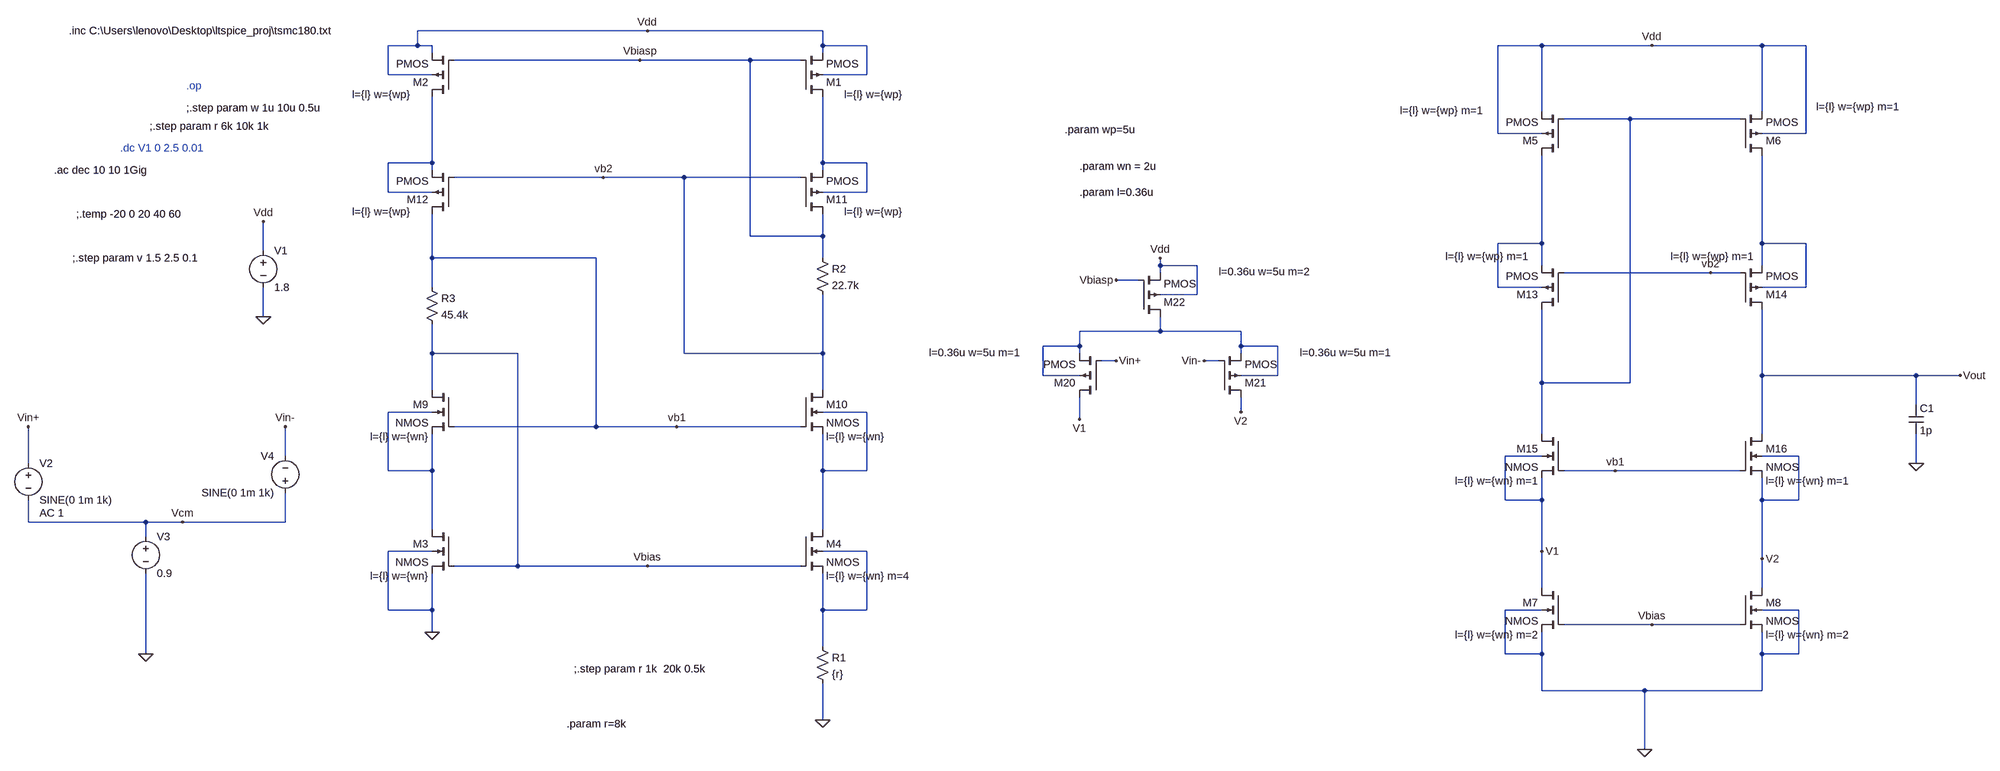
[diagram p0: schematic pmos-folded.asc]
pmos-folded.asc, the LTspice schematic file:
Version 4
SHEET 1 3392 1732
WIRE 336 80 -192 80
WIRE 848 80 336 80
WIRE -192 112 -192 80
WIRE -192 112 -256 112
WIRE -160 112 -192 112
WIRE 848 112 848 80
WIRE 944 112 848 112
WIRE 2416 112 2320 112
WIRE 2656 112 2416 112
WIRE 2896 112 2656 112
WIRE 2992 112 2896 112
WIRE -160 128 -160 112
WIRE 848 128 848 112
WIRE 320 144 -112 144
WIRE 560 144 320 144
WIRE 800 144 560 144
WIRE -256 176 -256 112
WIRE -160 176 -256 176
WIRE 944 176 944 112
WIRE 944 176 848 176
WIRE 2416 256 2416 112
WIRE 2896 256 2896 112
WIRE 2608 272 2464 272
WIRE 2848 272 2608 272
WIRE 2320 304 2320 112
WIRE 2416 304 2320 304
WIRE 2992 304 2992 112
WIRE 2992 304 2896 304
WIRE -160 368 -160 224
WIRE -160 368 -256 368
WIRE 848 368 848 224
WIRE 944 368 848 368
WIRE -160 384 -160 368
WIRE 848 384 848 368
WIRE 240 400 -112 400
WIRE 416 400 240 400
WIRE 800 400 416 400
WIRE -256 432 -256 368
WIRE -160 432 -256 432
WIRE 944 432 944 368
WIRE 944 432 848 432
WIRE 560 528 560 144
WIRE 848 528 848 480
WIRE 848 528 560 528
WIRE 2416 544 2416 352
WIRE 2416 544 2320 544
WIRE 2896 544 2896 352
WIRE 2992 544 2896 544
WIRE -528 560 -528 496
WIRE -160 576 -160 480
WIRE 224 576 -160 576
WIRE 848 576 848 528
WIRE 1584 592 1584 576
WIRE 1664 592 1584 592
WIRE 2416 592 2416 544
WIRE 2896 592 2896 544
WIRE 1584 608 1584 592
WIRE 2784 608 2464 608
WIRE 2848 608 2784 608
WIRE 1536 624 1488 624
WIRE -160 640 -160 576
WIRE 2320 640 2320 544
WIRE 2416 640 2320 640
WIRE 2992 640 2992 544
WIRE 2992 640 2896 640
WIRE 1664 656 1664 592
WIRE 1664 656 1584 656
WIRE -528 704 -528 640
WIRE 1584 736 1584 704
WIRE 1584 736 1408 736
WIRE 1760 736 1584 736
WIRE 1408 768 1408 736
WIRE 1408 768 1328 768
WIRE 1760 768 1760 736
WIRE 1840 768 1760 768
WIRE -160 784 -160 720
WIRE 48 784 -160 784
WIRE 416 784 416 400
WIRE 848 784 848 656
WIRE 848 784 416 784
WIRE 1408 784 1408 768
WIRE 1760 784 1760 768
WIRE 1488 800 1456 800
WIRE 1712 800 1680 800
WIRE 1328 832 1328 768
WIRE 1408 832 1328 832
WIRE 1840 832 1840 768
WIRE 1840 832 1760 832
WIRE 2896 832 2896 688
WIRE 3232 832 2896 832
WIRE 3328 832 3232 832
WIRE 2416 848 2416 688
WIRE 2608 848 2608 272
WIRE 2608 848 2416 848
WIRE -160 864 -160 784
WIRE 848 864 848 784
WIRE 3232 896 3232 832
WIRE -160 912 -256 912
WIRE 944 912 848 912
WIRE 1760 912 1760 880
WIRE 1408 928 1408 880
WIRE 224 944 224 576
WIRE 224 944 -112 944
WIRE 400 944 224 944
WIRE 800 944 400 944
WIRE 2416 960 2416 848
WIRE 2896 960 2896 832
WIRE -480 1008 -480 944
WIRE 2416 1008 2336 1008
WIRE 2976 1008 2896 1008
WIRE -1040 1024 -1040 944
WIRE 3232 1024 3232 960
WIRE -256 1040 -256 912
WIRE -160 1040 -160 960
WIRE -160 1040 -256 1040
WIRE 848 1040 848 960
WIRE 944 1040 944 912
WIRE 944 1040 848 1040
WIRE 2576 1040 2464 1040
WIRE 2848 1040 2576 1040
WIRE 2336 1104 2336 1008
WIRE 2416 1104 2416 1056
WIRE 2416 1104 2336 1104
WIRE 2896 1104 2896 1056
WIRE 2976 1104 2976 1008
WIRE 2976 1104 2896 1104
WIRE -1040 1152 -1040 1104
WIRE -784 1152 -1040 1152
WIRE -704 1152 -784 1152
WIRE -480 1152 -480 1088
WIRE -480 1152 -704 1152
WIRE -160 1168 -160 1040
WIRE 848 1168 848 1040
WIRE -784 1184 -784 1152
WIRE -160 1216 -256 1216
WIRE 944 1216 848 1216
WIRE 2416 1216 2416 1104
WIRE 2896 1232 2896 1104
WIRE 48 1248 48 784
WIRE 48 1248 -112 1248
WIRE 336 1248 48 1248
WIRE 800 1248 336 1248
WIRE 2416 1296 2416 1216
WIRE 2896 1296 2896 1232
WIRE -256 1344 -256 1216
WIRE -160 1344 -160 1264
WIRE -160 1344 -256 1344
WIRE 848 1344 848 1264
WIRE 944 1344 944 1216
WIRE 944 1344 848 1344
WIRE 2416 1344 2336 1344
WIRE 2976 1344 2896 1344
WIRE 2656 1376 2464 1376
WIRE 2848 1376 2656 1376
WIRE -160 1392 -160 1344
WIRE 848 1424 848 1344
WIRE -784 1440 -784 1264
WIRE 2336 1440 2336 1344
WIRE 2416 1440 2416 1392
WIRE 2416 1440 2336 1440
WIRE 2896 1440 2896 1392
WIRE 2976 1440 2976 1344
WIRE 2976 1440 2896 1440
WIRE 2416 1520 2416 1440
WIRE 2640 1520 2416 1520
WIRE 2896 1520 2896 1440
WIRE 2896 1520 2640 1520
WIRE 848 1584 848 1504
WIRE 2640 1648 2640 1520
FLAG -528 704 0
FLAG -528 496 Vdd
FLAG -160 1392 0
FLAG 848 1584 0
FLAG 336 1248 Vbias
FLAG 2656 112 Vdd
FLAG -784 1440 0
FLAG -1040 944 Vin+
FLAG -704 1152 Vcm
FLAG 3328 832 Vout
FLAG 3232 1024 0
FLAG 400 944 vb1
FLAG 240 400 vb2
FLAG 2784 608 vb2
FLAG 2576 1040 vb1
FLAG 336 80 Vdd
FLAG 2640 1648 0
FLAG 320 144 Vbiasp
FLAG -480 944 Vin-
FLAG 1488 800 Vin+
FLAG 1680 800 Vin-
FLAG 1488 624 Vbiasp
FLAG 1584 576 Vdd
FLAG 1408 928 V1
FLAG 1760 912 V2
FLAG 2416 1216 V1
FLAG 2896 1232 V2
FLAG 2656 1376 Vbias
DATAFLAG 848 1392 ""
DATAFLAG 688 1248 ""
DATAFLAG 80 144 ""
DATAFLAG 2752 112 ""
DATAFLAG 2672 272 ""
DATAFLAG 688 944 ""
DATAFLAG 80 400 ""
DATAFLAG 2592 608 ""
DATAFLAG 2704 1040 ""
DATAFLAG 3072 832 ""
DATAFLAG 1584 736 ""
SYMBOL pmos4 800 224 M180
WINDOW 123 95 5 Left 2
SYMATTR Value2 l={l} w={wp}
SYMATTR InstName M1
SYMBOL voltage -528 544 R0
SYMATTR InstName V1
SYMATTR Value 1.8
SYMBOL pmos4 -112 224 R180
WINDOW 123 95 5 Left 2
SYMATTR Value2 l={l} w={wp}
SYMATTR InstName M2
SYMBOL nmos4 -112 1168 M0
WINDOW 123 56 102 Left 2
SYMATTR Value2 l={l} w={wn}
SYMATTR InstName M3
SYMBOL nmos4 800 1168 R0
WINDOW 123 56 102 Left 2
SYMATTR Value2 l={l} w={wn} m=4
SYMATTR InstName M4
SYMBOL res 832 1408 R0
SYMATTR InstName R1
SYMATTR Value {r}
SYMBOL pmos4 2464 352 R180
WINDOW 123 176 98 Left 2
SYMATTR Value2 l={l} w={wp} m=1
SYMATTR InstName M5
SYMBOL pmos4 2848 352 M180
WINDOW 123 166 106 Left 2
SYMATTR Value2 l={l} w={wp} m=1
SYMATTR InstName M6
SYMBOL nmos4 2464 1296 M0
WINDOW 123 56 102 Left 2
SYMATTR Value2 l={l} w={wn} m=2
SYMATTR InstName M7
SYMBOL nmos4 2848 1296 R0
WINDOW 123 56 102 Left 2
SYMATTR Value2 l={l} w={wn} m=2
SYMATTR InstName M8
SYMBOL voltage -1040 1008 R0
WINDOW 123 24 124 Left 2
WINDOW 39 0 0 Left 0
SYMATTR Value2 AC 1
SYMATTR InstName V2
SYMATTR Value SINE(0 1m 1k)
SYMBOL voltage -784 1168 R0
SYMATTR InstName V3
SYMATTR Value 0.9
SYMBOL voltage -480 1104 R180
WINDOW 0 24 96 Left 2
WINDOW 3 24 16 Left 2
WINDOW 123 24 -12 Left 2
WINDOW 39 0 0 Left 0
SYMATTR InstName V4
SYMATTR Value SINE(0 1m 1k)
SYMBOL cap 3216 896 R0
SYMATTR InstName C1
SYMATTR Value 1p
SYMBOL nmos4 -112 864 M0
WINDOW 123 56 102 Left 2
SYMATTR Value2 l={l} w={wn}
SYMATTR InstName M9
SYMBOL nmos4 800 864 R0
WINDOW 123 56 102 Left 2
SYMATTR Value2 l={l} w={wn}
SYMATTR InstName M10
SYMBOL pmos4 800 480 M180
WINDOW 123 95 5 Left 2
SYMATTR Value2 l={l} w={wp}
SYMATTR InstName M11
SYMBOL pmos4 -112 480 R180
WINDOW 123 95 5 Left 2
SYMATTR Value2 l={l} w={wp}
SYMATTR InstName M12
SYMBOL res 832 560 R0
SYMATTR InstName R2
SYMATTR Value 22.7k
SYMBOL res -176 624 R0
SYMATTR InstName R3
SYMATTR Value 45.4k
SYMBOL pmos4 2464 688 R180
WINDOW 123 77 116 Left 2
SYMATTR Value2 l={l} w={wp} m=1
SYMATTR InstName M13
SYMBOL pmos4 2848 688 M180
WINDOW 123 -151 116 Left 2
SYMATTR Value2 l={l} w={wp} m=1
SYMATTR InstName M14
SYMBOL nmos4 2464 960 M0
WINDOW 123 56 102 Left 2
SYMATTR Value2 l={l} w={wn} m=1
SYMATTR InstName M15
SYMBOL nmos4 2848 960 R0
WINDOW 123 56 102 Left 2
SYMATTR Value2 l={l} w={wn} m=1
SYMATTR InstName M16
SYMBOL pmos4 1456 880 R180
WINDOW 123 176 98 Left 2
SYMATTR Value2 l=0.36u w=5u m=1
SYMATTR InstName M20
SYMBOL pmos4 1712 880 M180
WINDOW 123 176 98 Left 2
SYMATTR Value2 l=0.36u w=5u m=1
SYMATTR InstName M21
SYMBOL pmos4 1536 704 M180
WINDOW 123 176 98 Left 2
SYMATTR Value2 l=0.36u w=5u m=2
SYMATTR InstName M22
TEXT -952 80 Left 2 !.inc C:\\Users\\lenovo\\Desktop\\ltspice_proj\\tsmc180.txt
TEXT -696 200 Left 2 ;.op
TEXT -696 248 Left 2 !;.step param w 1u 10u 0.5u
TEXT -776 288 Left 2 !;.step param r 6k 10k 1k
TEXT -840 336 Left 2 ;.dc V1 0 2.5 0.01
TEXT -984 384 Left 2 !.ac dec 10 10 1Gig
TEXT -936 480 Left 2 !;.temp -20 0 20 40 60
TEXT -944 576 Left 2 !;.step param v 1.5 2.5 0.1
TEXT 176 1472 Left 2 !;.step param r 1k  20k 0.5k
TEXT 1376 296 Left 2 !.param wp=5u
TEXT 1408 376 Left 2 !.param wn = 2u
TEXT 1408 432 Left 2 !.param l=0.36u
TEXT 160 1592 Left 2 !.param r=8k

The netlist it stands for:
* pmos-folded.asc
M1 N003 Vbiasp Vdd Vdd PMOS l={l} w={wp}
V1 Vdd 0 1.8
M2 N002 Vbiasp Vdd Vdd PMOS l={l} w={wp}
M3 N007 Vbias 0 0 NMOS l={l} w={wn}
M4 N008 Vbias N009 N009 NMOS l={l} w={wn} m=4
R1 N009 0 {r}
M5 N004 N001 Vdd Vdd PMOS l={l} w={wp} m=1
M6 N005 N001 Vdd Vdd PMOS l={l} w={wp} m=1
M7 V1 Vbias 0 0 NMOS l={l} w={wn} m=2
M8 V2 Vbias 0 0 NMOS l={l} w={wn} m=2
V2 Vin+ Vcm SINE(0 1m 1k) AC 1
V3 Vcm 0 0.9
V4 Vcm Vin- SINE(0 1m 1k)
C1 Vout 0 1p
M9 Vbias vb1 N007 N007 NMOS l={l} w={wn}
M10 vb2 vb1 N008 N008 NMOS l={l} w={wn}
M11 Vbiasp vb2 N003 N003 PMOS l={l} w={wp}
M12 vb1 vb2 N002 N002 PMOS l={l} w={wp}
R2 Vbiasp vb2 22.7k
R3 vb1 Vbias 45.4k
M13 N001 vb2 N004 N004 PMOS l={l} w={wp} m=1
M14 Vout vb2 N005 N005 PMOS l={l} w={wp} m=1
M15 N001 vb1 V1 V1 NMOS l={l} w={wn} m=1
M16 Vout vb1 V2 V2 NMOS l={l} w={wn} m=1
M20 V1 Vin+ N006 N006 PMOS l=0.36u w=5u m=1
M21 V2 Vin- N006 N006 PMOS l=0.36u w=5u m=1
M22 N006 Vbiasp Vdd Vdd PMOS l=0.36u w=5u m=2
.model NMOS NMOS
.model PMOS PMOS
.lib standard.mos
.inc C:\Users\lenovo\Desktop\ltspice_proj\tsmc180.txt
* .op
;.step param w 1u 10u 0.5u
;.step param r 6k 10k 1k
* .dc V1 0 2.5 0.01
.ac dec 10 10 1Gig
;.temp -20 0 20 40 60
;.step param v 1.5 2.5 0.1
;.step param r 1k  20k 0.5k
.param wp=5u
.param wn = 2u
.param l=0.36u
.param r=8k
.backanno
.end